# EAGLE design VentaConnected_ESP8266_V0.01_2018-09-03.FET (EAGLE 8.5.0)
VERSION: 0.01
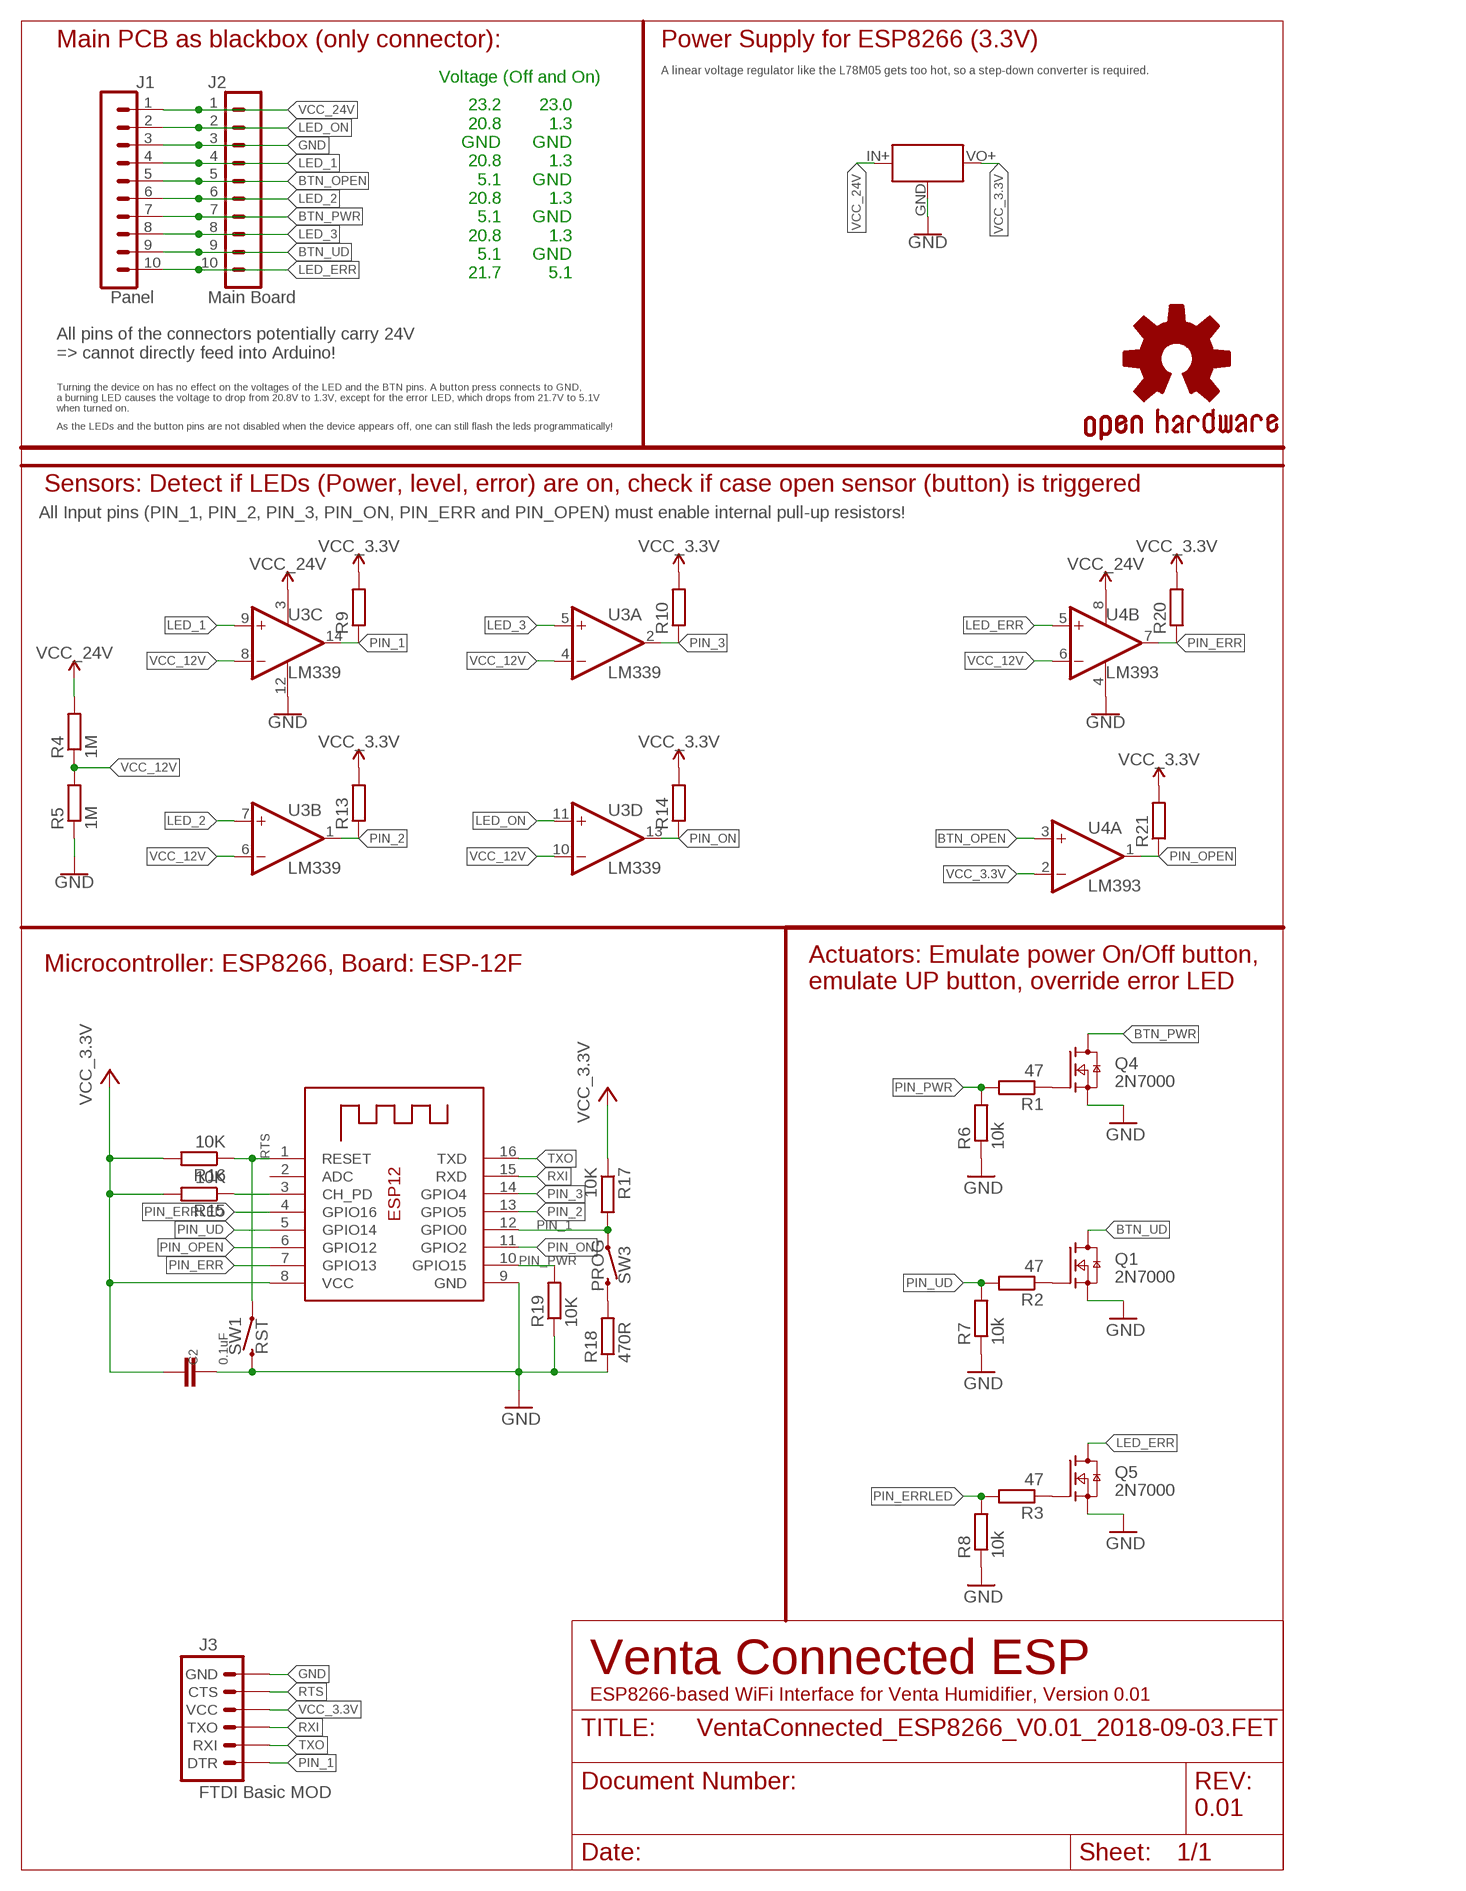
[diagram p0: schematic, sheet 1]

## Parts
C2  0.1uF  C-EUC0805  [C0805]
GOLD_ORB_SM1  OSHWLOGO_GOLD_ORB_SM  [OSHW2]
J1  Panel  CONN_05X2SHD  [2X5-SHROUDED]
J2  Main Board  CONN_05X2PTH  [2X5]
J3  FTDI Basic MOD  ARDUINO_SERIAL_PROGRAMPTH  [1X06]
Q1  2N7000  2N7002E  [SOT23]
Q4  2N7000  2N7002E  [SOT23]
Q5  2N7000  2N7002E  [SOT23]
R1  47  R-EU_R0805  [R0805]
R2  47  R-EU_R0805  [R0805]
R3  47  R-EU_R0805  [R0805]
R4  1M  R-EU_R0805  [R0805]
R5  1M  R-EU_R0805  [R0805]
R6  10k  R-EU_R0805  [R0805]
R7  10k  R-EU_R0805  [R0805]
R8  10k  R-EU_R0805  [R0805]
R9  R-EU_R0805  [R0805]
R10  R-EU_R0805  [R0805]
R13  R-EU_R0805  [R0805]
R14  R-EU_R0805  [R0805]
R15  10K  R-EU_R0805  [R0805]
R16  10K  R-EU_R0805  [R0805]
R17  10K  R-EU_R0805  [R0805]
R18  470R  R-EU_R0805  [R0805]
R19  10K  R-EU_R0805  [R0805]
R20  R-EU_R0805  [R0805]
R21  R-EU_R0805  [R0805]
SW1  RST  MOMENTARY-SWITCH-SPST-SMD-6.0X3.5MM  [TACTILE_SWITCH_SMD_6.0X3.5MM]
SW3  PROG  MOMENTARY-SWITCH-SPST-SMD-6.0X3.5MM  [TACTILE_SWITCH_SMD_6.0X3.5MM]
U2  3.3V_BUCK_CONVERTER  MINI_BUCK_CONVERTER_UPSIDEDOWN  [MINI_BUCK_CONVERTER_UPDOWN]
U3  LM339  TLC339D  [SO14]
U4  LM393  LM393D  [SO08]
X2  ESP-12e  ESP-12  [ESP-12]

## Nets
BTN_OPEN: J1.5 J2.5 U4.3(A:+IN)
BTN_PWR: J1.7 J2.7 Q4.3(D)
BTN_UD: J1.9 J2.9 Q1.3(D)
CH_PD: R15.1 X2.3(CH_PD)
GND: C2.1 J1.3 J2.3 J3.6(GND) Q1.2(S) Q4.2(S) Q5.2(S) R5.1 R6.1 R7.1 R8.1 R18.1 R19.1 SW1.2 U2.GND U3.12(P:V-) U4.4(P:V-) X2.9(GND)
LED_1: J1.4 J2.4 U3.9(C:+IN)
LED_2: J1.6 J2.6 U3.7(B:+IN)
LED_3: J1.8 J2.8 U3.5(A:+IN)
LED_ERR: J1.10 J2.10 Q5.3(D) U4.5(B:+IN)
LED_ON: J1.2 J2.2 U3.11(D:+IN)
N$2: Q4.1(G) R1.1
N$4: R18.2 SW3.2
N$5: Q5.1(G) R3.1
N$6: Q1.1(G) R2.1
PIN_1: J3.1(DTR) R9.1 R17.2 SW3.1 U3.14(C:OUT) X2.12(GPIO0)
PIN_2: R13.1 U3.1(B:OUT) X2.13(GPIO5)
PIN_3: R10.1 U3.2(A:OUT) X2.14(GPIO4)
PIN_ERR: R20.1 U4.7(B:OUT) X2.7(GPIO13)
PIN_ERRLED: R3.2 R8.2 X2.4(GPIO16)
PIN_ON: R14.1 U3.13(D:OUT) X2.11(GPIO2)
PIN_OPEN: R21.1 U4.1(A:OUT) X2.6(GPIO12)
PIN_PWR: R1.2 R6.2 R19.2 X2.10(GPIO15)
PIN_UD: R2.2 R7.2 X2.5(GPIO14)
RTS: J3.5(CTS) R16.1 SW1.1 X2.1(RESET)
RXI: J3.3(TXO) X2.15(RXD)
TXO: J3.2(RXI) X2.16(TXD)
VCC_3.3V: C2.2 J3.4(VCC) R9.2 R10.2 R13.2 R14.2 R15.2 R16.2 R17.1 R20.2 R21.2 U2.VO+(VOUT) U4.2(A:-IN) X2.8(VCC)
VCC_12V: R4.1 R5.2 U3.4(A:-IN) U3.6(B:-IN) U3.8(C:-IN) U3.10(D:-IN) U4.6(B:-IN)
VCC_24V: J1.1 J2.1 R4.2 U2.IN+(VIN) U3.3(P:V+) U4.8(P:V+)
Unconnected: X2.2(ADC)

## Notes on the sheet
- Main PCB as blackbox (only connector): | Power Supply for ESP8266 (3.3V)
- A linear voltage regulator like the L78M05 gets too hot, so a step-down converter is required.
- Voltage (Off and On)
- 23.2
  20.8
  GND
  20.8
  5.1
  20.8
  5.1
  20.8
  5.1
  21.7
- 23.0
  1.3
  GND
  1.3
  GND
  1.3
  GND
  1.3
  GND
  5.1
- All pins of the connectors potentially carry 24V 
  => cannot directly feed into Arduino!
- Turning the device on has no effect on the voltages of the LED and the BTN pins. A button press connects to GND, 
  a burning LED causes the voltage to drop from 20.8V to 1.3V, except for the error LED, which drops from 21.7V to 5.1V 
  when turned on.
- As the LEDs and the button pins are not disabled when the device appears off, one can still flash the leds programmatically!
- Sensors: Detect if LEDs (Power, level, error) are on, check if case open sensor (button) is triggered
- All Input pins (PIN_1, PIN_2, PIN_3, PIN_ON, PIN_ERR and PIN_OPEN) must enable internal pull-up resistors!
- Microcontroller: ESP8266, Board: ESP-12F
- Actuators: Emulate power On/Off button,
  emulate UP button, override error LED
- Venta Connected ESP
- ESP8266-based WiFi Interface for Venta Humidifier, Version 0.01

## Library data of the parts
C2 = resistor:C-EU: CAPACITOR, European symbol
GOLD_ORB_SM1 = bfl:OSHWLOGO: These are Open-Source Hardware logos.
J1 = opentools:CONN_05X2: Multi connection point. Often used as Generic Header-pin footprint for 0.1 inch spaced/style header connections For AVR SPI programming port, see special device with nice symbol: "AVR_SPI_PROG_5x2.dev" You can populate with any combo of single row headers, but if you'd like an exact match, check these: 2x5 AVR ICSP Male Header <https://www.sparkfun.com/products/778> (PRT-00778) 2x5 Pin Shrouded Header <https://www.sparkfun.com/products/8506> (PRT-08506) On any of the 0.1 inch spaced packages, you can populate with these: Break Away Headers - Straight <https://www.sparkfun.com/products/116> (PRT-00116) Break Away Male Headers - Right Angle <https://www.sparkfun.com/products/553> (PRT-00553) Female Headers <https://www.sparkfun.com/products/115> (PRT-00115) Break Away Headers - Machine Pin <https://www.sparkfun.com/products/117> (PRT-00117) Break Away Female Headers - Swiss Machine Pin <https://www.sparkfun.com/products/743> (PRT-00743) Special note: the shrouded connector mates well with our 5x2 ribbon cables: 2x5 Pin IDC Ribbon Cable <https://www.sparkfun.com/products/8535> (PRT-08535); PROD_ID: CONN-08671; SF_ID: PRT-08506
J2 = opentools:CONN_05X2: Multi connection point. Often used as Generic Header-pin footprint for 0.1 inch spaced/style header connections For AVR SPI programming port, see special device with nice symbol: "AVR_SPI_PROG_5x2.dev" You can populate with any combo of single row headers, but if you'd like an exact match, check these: 2x5 AVR ICSP Male Header <https://www.sparkfun.com/products/778> (PRT-00778) 2x5 Pin Shrouded Header <https://www.sparkfun.com/products/8506> (PRT-08506) On any of the 0.1 inch spaced packages, you can populate with these: Break Away Headers - Straight <https://www.sparkfun.com/products/116> (PRT-00116) Break Away Male Headers - Right Angle <https://www.sparkfun.com/products/553> (PRT-00553) Female Headers <https://www.sparkfun.com/products/115> (PRT-00115) Break Away Headers - Machine Pin <https://www.sparkfun.com/products/117> (PRT-00117) Break Away Female Headers - Swiss Machine Pin <https://www.sparkfun.com/products/743> (PRT-00743) Special note: the shrouded connector mates well with our 5x2 ribbon cables: 2x5 Pin IDC Ribbon Cable <https://www.sparkfun.com/products/8535> (PRT-08535); PROD_ID: CONN-08499; SF_ID: PRT-0778
J3 = SparkFun:ARDUINO_SERIAL_PROGRAM
Q1 Q4 Q5 = NXP_60_26022015:2N7002: N-channel TrenchMOS FET N-channel enhancement mode Field-Effect Transistor (FET) in a plastic package using TrenchMOS technology. AAL Eindhoven MK
R1-R10 R13 R14 R20 R21 = resistor:R-EU_: RESISTOR, European symbol
R15-R19 = rcl:R-EU_: RESISTOR, European symbol
SW1 SW3 = SparkFun-Switches:MOMENTARY-SWITCH-SPST: Momentary Switch (Pushbutton) - SPST Normally-open (NO) SPST momentary switches (buttons, pushbuttons). Variants PTH-12MM - 12mm square, through-hole Momentary Pushbutton Switch - 12mm Square <https://www.sparkfun.com/products/9190> (COM-09190) PTH-6.0MM, PTH-6.0MM-KIT - 6.0mm square, through-hole Mini Pushbutton Switch <https://www.sparkfun.com/products/97> (COM-00097) KIT package intended for soldering kit's - only one side of pads' copper is exposed. PTH-RIGHT-ANGLE-KIT - Right-angle, through-hole Right Angle Tactile Button <https://www.sparkfun.com/products/10791> - Used on SparkFun BigTime Watch Kit <https://www.sparkfun.com/products/11734> SMD-12MM - 12mm square, surface-mount Tactile Button - SMD (12mm) <https://www.sparkfun.com/products/12993> (COM-12993) Used on SparkFun PicoBoard <https://www.sparkfun.com/products/11888> SMD-4.5MM - 4.5mm Square Trackball Switch Used on SparkFun Blackberry Trackballer Breakout <https://www.sparkfun.com/products/13169> SMD-4.6MMX2.8MM - 4.60mm x 2.80mm, surface mount Used on SparkFun SAMD21 Mini Breakout <https://www.sparkfun.com/products/13664> SMD-5.2MM, SMD-5.2-REDUNDANT - 5.2mm square, surface-mount Mini Pushbutton Switch - SMD <https://www.sparkfun.com/products/8720> (COM-08720) Used on Arduino Pro Mini <https://www.sparkfun.com/products/11114> REDUNDANT package connects both switch circuits together SMD-6.0X3.5MM - 6.0 x 3.5mm, surface mount Momentary Reset Switch SMD <https://www.sparkfun.com/products/8229> (COM-08229) SMD-6.2MM-TALL - 6.2mm square, surface mount Tactile Button - SMD (6mm) <https://www.sparkfun.com/products/12992> Used on SparkFun Digital Sandbox <https://www.sparkfun.com/products/12651> SMD-RIGHT-ANGLE - Right-angle, surface mount Used on SparkFun Block for Intel® Edison - Arduino <https://www.sparkfun.com/products/13036>; PROD_ID: SWCH-00815; SF_SKU: COM-08229
U2 = opentools:MINI_BUCK_CONVERTER: 4.5-40V Step Down Buck Converter
U3 = linear:TLC339: COMPARATOR
U4 = linear:LM393: COMPARATOR
X2 = adafruit:ESP-12

## Net classes
0 default: width 0.203 mm
1 vcc: width 0.254 mm

## Board
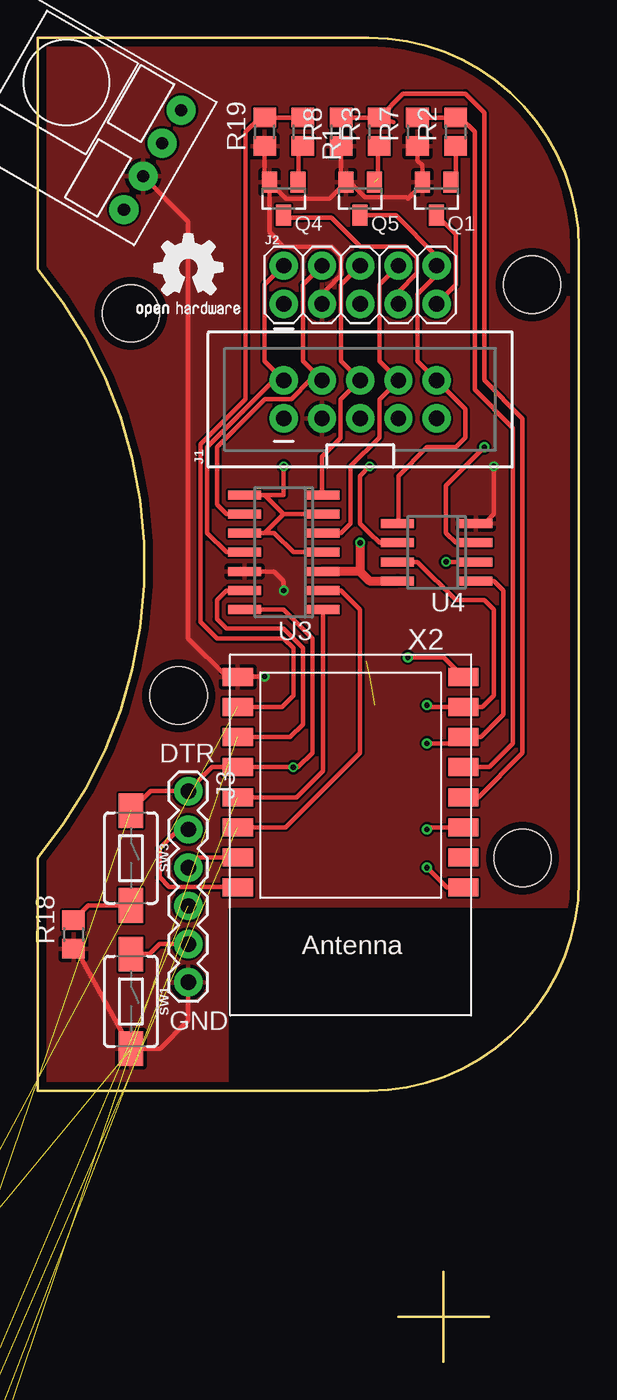
[diagram p1: board, top side]
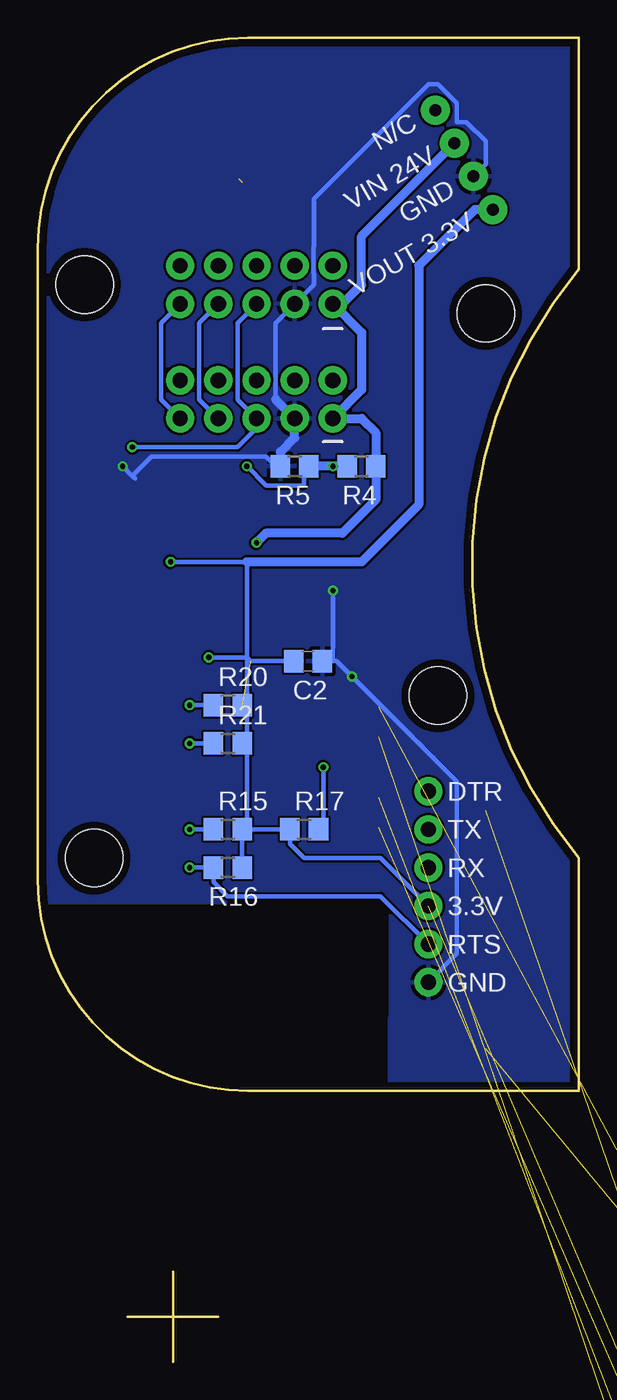
[diagram p2: board, bottom side, seen from below]

Size 35.99 x 88 mm. Coordinates in mm from the lower left corner, seen from the top.
Outline: 26.99,6 26.99,0
Outline: 23.99,3 29.99,3
Outline: 21.99,18 arc90 35.99,32 35.99,74 arc90 21.99,88 0,88 0,72.6 arc-80 0,33.48 0,18 21.99,18
Copper layers (1*16): Top 0.035mm / dielectric 1.6mm / Bottom 0.035mm
Design rules "Elecrow_2-layer_PCB_eagle_rule": minimum track width 6mil, minimum drill 12mil, track to track 6mil, track to pad 6mil, pad to pad 6mil, via to via 8mil, smd to smd 0mil, copper to edge 20mil, drill to drill 10mil, minimum pad ring 6mil, minimum via ring 6mil, stop-mask expansion 0mil, vias tented up to drill 100mil, thermal gap 10mil
Holes 3.81 mm at 6.2,69.67 32.87,71.58 32.24,33.48 9.38,44.27

### Footprints (pad centres in the part's own frame; a part is rotated, then mirrored left to right if it is on the bottom)
C0805 = smd 1.3 x 1.5: 1 -0.95,0; 2 0.95,0
2X5-SHROUDED = drill 1.016 pad 1.88: 1 -1.27,5.08; 2 1.27,5.08; 3 -1.27,2.54; 4 1.27,2.54; 5 -1.27,0; 6 1.27,0; 7 -1.27,-2.54; 8 1.27,-2.54; 9 -1.27,-5.08; 10 1.27,-5.08
2X5 = drill 1.016 pad 1.88: 1 0,0; 2 0,2.54; 3 2.54,0; 4 2.54,2.54; 5 5.08,0; 6 5.08,2.54; 7 7.62,0; 8 7.62,2.54; 9 10.16,0; 10 10.16,2.54
1X06 = drill 1.016 pad 1.88: 1 0,0; 2 2.54,0; 3 5.08,0; 4 7.62,0; 5 10.16,0; 6 12.7,0
SOT23 = smd 1 x 1.4: 1 -0.95,-1.1; 2 0.95,-1.1; 3 0,1.1
R0805 = smd 1.3 x 1.5: 1 -0.95,0; 2 0.95,0
TACTILE_SWITCH_SMD_6.0X3.5MM = smd 2.3 x 1.6: 1 -3.15,0; 2 3.15,0
MINI_BUCK_CONVERTER_UPDOWN = drill 0.8 pad 1.93: EN -1.27,1.27; GND -6.35,1.27; IN+ -3.81,1.27; VO+ -8.89,1.27
SO14 = smd 0.6 x 2.2: 1 -3.81,-2.6; 2 -2.54,-2.6; 3 -1.27,-2.6; 4 0,-2.6; 5 1.27,-2.6; 6 2.54,-2.6; 7 3.81,-2.6; 8 3.81,2.6; 9 2.54,2.6; 10 1.27,2.6; 11 0,2.6; 12 -1.27,2.6; 13 -2.54,2.6; 14 -3.81,2.6
SO08 = smd 0.6 x 2.2: 1 -1.905,-2.6; 2 -0.635,-2.6; 3 0.635,-2.6; 4 1.905,-2.6; 5 1.905,2.6; 6 0.635,2.6; 7 -0.635,2.6; 8 -1.905,2.6
ESP-12 = smd 2 x 1.2: 1 -7.5,4.5; 2 -7.5,2.5; 3 -7.5,0.5; 4 -7.5,-1.5; 5 -7.5,-3.5; 6 -7.5,-5.5; 7 -7.5,-7.5; 8 -7.5,-9.5; 9 7.5,-9.5; 10 7.5,-7.5; 11 7.5,-5.5; 12 7.5,-3.5; 13 7.5,-1.5; 14 7.5,0.5; 15 7.5,2.5; 16 7.5,4.5

### Placement (x,y rotation side)
C2  18.01,46.56 180 bottom
GOLD_ORB_SM1  6.2,68.41 0 top
J1  21.44,63.96 90 top
J2  16.36,70.31 0 top
J3  10.01,37.92 270 top
Q1  26.52,77.3 180 top
Q4  16.36,77.3 180 top
Q5  21.44,77.3 180 top
R1  17.63,81.74 90 top
R2  27.79,81.74 90 top
R3  22.71,81.74 90 top
R4  14.46,59.52 0 bottom
R5  18.9,59.52 0 bottom
R6  -12.85,-3.35 0 top  (outside the outline)
R7  25.25,81.74 90 top
R8  20.17,81.74 90 top
R9  -12.85,-21.13 0 top  (outside the outline)
R10  -12.85,-26.84 0 top  (outside the outline)
R13  -12.85,-32.56 0 top  (outside the outline)
R14  -12.85,-38.27 0 top  (outside the outline)
R15  23.35,35.38 0 bottom
R16  23.35,32.84 0 bottom
R17  18.27,35.38 0 bottom
R18  2.39,28.4 90 top
R19  15.09,81.74 90 top
R20  23.35,43.64 0 bottom
R21  23.35,41.1 0 bottom
SW1  6.2,23.95 270 top
SW3  6.2,33.48 270 top
U2  11.28,83.64 60 top
U3  16.36,53.8 90 top
U4  26.52,53.8 90 top
X2  20.81,36.02 180 top

### Tracks (layer width: path | path; a pad name or v marks a point on that pad's centre or on a via)
BTN_OPEN  (via drill 0.35)
  Top 0.305: v29.7,60.78 27.16,58.24 27.16,55.07 27.79,54.44 U4.3
  Bottom 0.305: J2.5 22.71,69.04 22.71,63.96 J1.5 21.44,62.05 22.71,60.78 v29.7,60.78
BTN_PWR
  Top 0.305: J2.7 23.98,71.09 25.23,72.33 25.23,73.37 24.5,74.09 21.47,74.09 19.54,76.03 17.63,76.03 16.53,76.03 Q4.3
  Bottom 0.305: J2.7 25.25,69.04 25.25,63.96 J1.7
BTN_UD
  Top 0.305: J2.9 27.79,71.58 27.79,74.92 Q1.3
  Bottom 0.305: J2.9 27.79,69.04 27.79,63.96 J1.9
CH_PD  (via drill 0.35)
  Top 0.305: v25.89,35.38 26.02,35.52 X2.3
  Bottom 0.305: R15.1 v25.89,35.38
GND  (via drill 0.35)  (1 unrouted)
  Top 0.305: 13.33,45.55 v15.09,45.55 | 13.33,45.55 X2.9 | R18.1 2.74,27.11 SW1.2 8.13,20.8 10.01,22.68 J3.6 | J2.3 18.9,70.94 19.72,71.76 19.72,71.77 20.17,72.22 20.17,73.49 19.54,74.12 16.36,74.12 15.41,75.07 Q4.2 | v30.33,59.52 30.33,56.34 29.7,55.7 U4.4 | U3.12 15.73,52.53 16.36,51.9 v16.36,51.26 | U2.GND 10.01,75.78 10.01,48.09 12.55,45.55 13.33,45.55 | R7.1 25.25,79.83 25.57,79.52 Q1.2 25.57,78.25 24.62,77.3 24.52,77.39 21.77,77.39 20.76,78.39 Q5.2 | R8.1 20.17,78.72 Q5.2 | R19.1 15.09,78.72 Q4.2 | Q4.2 16.51,77.3 19.39,77.3 Q5.2
  Bottom 0.305: 20.17,63.96 20.17,69.04 J2.3 17.63,71.58 17.63,72.31 17.66,72.33 17.66,74.09 17.63,74.12 17.63,77.3 10.01,84.92 9.38,84.92 8.74,84.28 8.71,84.27 8.68,84.22 8.11,83.64 8.11,82.38 7.47,82.38 6.2,81.11 6.2,79.59 U2.GND | 16.36,46.56 C2.1 | 16.36,46.56 16.11,46.56 v15.09,45.55 8.11,38.56 8.11,27.13 J3.6 | v16.36,51.26 16.36,46.56 | 29.7,58.88 29.5,58.69 | 29.7,58.88 v30.33,59.52 | R5.1 20.17,59.52 20.81,60.15 28.43,60.15 29.7,58.88
  Bottom 0.61: R5.1 19.85,60.47 18.9,61.42 J1.3 20.17,63.96
  pour Top (isolate 0.152): -0.78,88.09 -0.15,74.12 -0.78,72.85 3.03,67.14 5.57,62.05 6.84,53.8 6.2,46.18 1.76,36.02 -0.78,32.84 -0.78,16.97 12.55,16.97 12.55,30.3 36.05,30.3 36.68,74.12 32.87,84.28 23.98,88.09
  pour Bottom (isolate 0.152): -0.78,88.34 -0.78,73.1 1.12,69.93 4.93,62.31 6.84,55.32 6.2,45.8 1.12,35.64 -0.78,33.1 -0.78,17.22 10.01,17.22 12.55,17.86 12.55,30.56 36.05,30.56 36.68,73.74 32.87,83.9 23.98,87.71 12.55,87.71
LED_1
  Top 0.305: J2.4 17.63,71.58 17.63,66.5 J1.4 18.12,65.23 16.88,63.98 15.13,63.98 15.1,63.95 | 15.1,63.95 15.1,63.96 | 15.1,63.95 11.92,60.78 11.92,56.97 12.55,56.34 U3.9
LED_2
  Top 0.305: J2.6 20.17,71.58 20.17,66.5 J1.6 | J1.6 21.44,64.59 | J1.6 20.15,63.94 20.15,61.4 18.9,60.15 18.9,57.67 U3.7
LED_3
  Top 0.305: J2.8 22.71,71.58 22.71,66.5 J1.8 22.71,63.96 22.71,61.42 20.81,59.52 20.81,55.7 20.17,55.07 U3.5
LED_ERR
  Top 0.305: U4.5 23.98,55.77 23.98,58.88 25.89,60.78 27.79,60.78 28.43,61.42 28.43,63.33 J1.10 25.25,66.5 25.25,70.94 26.52,72.22 J2.10 26.52,73.48 23.81,76.19 Q5.3
LED_ON
  Top 0.305: J2.2 15.09,71.58 15.09,66.5 J1.2 15.73,65.23 11.28,60.78 11.28,55.07 12.55,53.8 U3.11
N$2
  Top 0.305: Q4.1 17.34,78.6 17.34,80.5 R1.1
N$4
  Top 0.305: R18.2 3.37,30.33 SW3.2
N$5  (1 unrouted)
  Top 0.305: R3.1 22.64,80.72 22.64,78.64
N$6
  Top 0.305: R2.1 27.79,78.72 Q1.1
PIN_1  (via drill 0.35)  (1 unrouted)
  Top 0.305: U3.14 16.36,49.99 18.27,48.09 18.27,40.47 17.32,39.52 v17,39.52 X2.12 11.61,39.52 J3.1 7.5,37.92 SW3.1
  Bottom 0.305: v17,39.52 17,35.7 R17.2
PIN_2  (1 unrouted)
  Top 0.305: U3.1 18.96,39.26 17.23,37.52 X2.13
PIN_3  (1 unrouted)
  Top 0.305: U3.2 20.17,51.26 21.44,49.99 21.44,40.47 16.5,35.52 X2.14
PIN_ERR  (via drill 0.35)
  Top 0.305: U4.7 25.25,53.16 27.79,50.62 29.7,50.62 30.33,49.99 30.33,44.27 29.58,43.52 X2.7 26.01,43.52 v25.89,43.64
  Bottom 0.305: v25.89,43.64 R20.1
PIN_ERRLED
  Top 0.305: R3.2 23.66,82.38 | X2.4 29.29,37.52 32.24,40.47 32.24,62.69 29.7,65.23 29.7,83.01 28.43,84.28 24.3,84.28 R3.2 | R8.2 R3.2
PIN_ON  (1 unrouted)
  Top 0.305: U3.13 12.55,51.26 11.92,50.62 11.92,49.35 12.55,48.72 16.36,48.72 17.63,47.45 17.63,42.37 16.78,41.52 X2.11
PIN_OPEN  (via drill 0.35)
  Top 0.305: U4.1 30.33,51.9 30.97,51.26 30.97,43.01 29.48,41.52 X2.6 27.89,41.1 v25.89,41.1
  Bottom 0.305: R21.1 v25.89,41.1
PIN_PWR  (1 unrouted)
  Top 0.305: X2.10 16.24,43.52 17,44.27 17,47.44 16.35,48.09 11.92,48.09 10.83,49.18 10.83,60.97 13.82,63.97 13.82,81.74 14.77,82.69 R19.2 R1.2
PIN_UD
  Top 0.305: X2.5 30.02,39.52 31.6,41.1 31.6,62.05 29.06,64.59 29.06,81.74 28.11,82.69 R2.2 R7.2
RTS  (via drill 0.35)
  Top 0.305: X2.1 27.21,31.52 v25.89,32.84 | SW1.1 7.45,27.11 8.11,27.77 J3.5
  Bottom 0.305: v25.89,32.84 R16.1 24.3,31.89 23.35,30.94 13.19,30.94 J3.5
RXI
  Top 0.305: X2.15 10.69,33.52 J3.3
TXO
  Top 0.305: J3.2 9.38,35.38 8.11,34.11 8.11,32.21 8.74,31.57 13.25,31.57 X2.16
VCC_3.3V  (via drill 0.35)  (6 unrouted)
  Top 0.305: v24.62,46.81 27.01,46.81 X2.8 | U4.2 v27.16,53.16
  Bottom 0.305: 22.08,35.38 R17.1 19.22,34.43 18.27,33.48 13.19,33.48 J3.4 | 22.08,35.38 R15.2 R16.2 | 22.08,46.81 22.08,53.16 v27.16,53.16 | 22.08,46.81 22.08,35.38 | C2.2 21.82,46.56 22.08,46.81 | 22.08,46.81 v24.62,46.81 | R21.2 arc-90 22.08,41.42 22.08,45.55
  Bottom 0.61: U2.VO+ 6.92,76.58 10.65,72.85 10.65,56.98 14.46,53.16 22.08,53.16
VCC_12V  (via drill 0.35)
  Top 0.305: 15.09,57.61 16.36,56.34 | 16.36,56.34 U3.6 | 16.36,56.34 15.09,55.07 | 15.09,55.07 U3.10 | 15.09,55.07 15.73,55.07 17,53.8 U3.4 | v16.36,59.52 16.36,57.61 15.09,57.61 | 15.09,57.61 U3.8 | v22.08,59.52 21.44,58.88 21.44,55.7 22.08,55.07 22.71,54.44 U4.6
  Bottom 0.305: R5.2 18.27,59.2 18.27,58.24 20.81,58.24 v22.08,59.52
  Bottom 0.61: R4.1 v16.36,59.52 R5.2
VCC_24V  (via drill 0.35)
  Top 0.61: v21.44,54.44 21.44,52.53 | 21.44,52.53 U3.3 | 21.44,52.53 22.08,51.9 U4.8
  Bottom 0.61: U2.IN+ 14.46,74.8 14.46,71.58 15.73,70.31 J2.1 14.46,68.41 14.46,64.59 J1.1 14.46,62.69 13.51,61.74 R4.2 13.51,57.29 15.73,55.07 20.81,55.07 v21.44,54.44

### Text on the board
tOrigins: PROG | RESET
bOrigins: VentaConnected for ESP8266 / R. Kainhofer / Version 0.01, 26.11.2017
tNames: DTR | GND
bNames: N/C / VIN 24V / GND / VOUT 3.3V | DTR / TX / RX / 3.3V / RTS / GND